# EAGLE design d11toy1 (EAGLE 6.6.0)
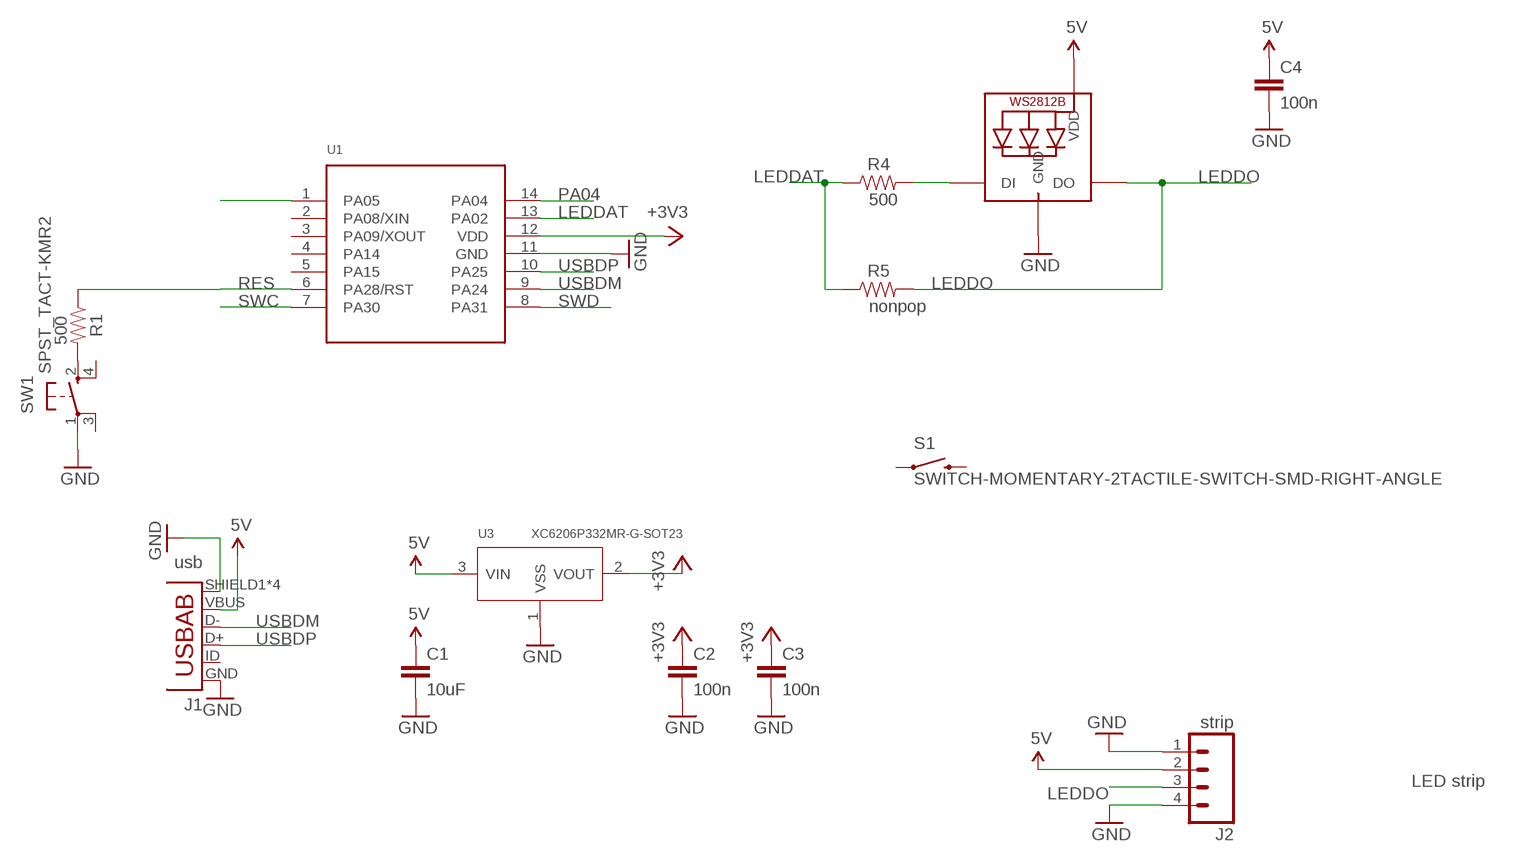
[diagram p0: schematic, sheet 1]

## Parts
C1  10uF  CAP0603-CAP  [0603-CAP]
C2  100n  CAP0603-CAP  [0603-CAP]
C3  100n  CAP0603-CAP  [0603-CAP]
C4  100n  CAP0603-CAP  [0603-CAP]
J1  usb  USB-AB  [USB-AB-MICRO-SMD]
J2  strip  M04NO_SILK_ALL_ROUND  [1X04_NO_SILK_ALL_ROUND]
LED1  WS2812B3535  [LED3535]
R1  500  RESISTOR0603-RES  [0603-RES]
R4  500  RESISTOR0603-RES  [0603-RES]
R5  nonpop  RESISTOR0603-RES  [0603-RES]
S1  SWITCH-MOMENTARY-2TACTILE-SWITCH-SMD-RIGHT-ANGLE  [TACTILE_SWITCH-SMD-RIGHT-ANGLE]
SW1  SPST_TACT-KMR2  [KMR2]
U1  SAMD11C14  [SO14]
U3  XC6206P332MR-G-SOT23  PMIC-LDO-XC6206P332MR-G(SOT23)  [SOT-23]

## Nets
5V: C1.1 C4.1 J1.VBUS J2.2 LED1.2(VDD) U3.3(VIN)
+3V3: C2.1 C3.1 U1.12(VDD) U3.2(VOUT)
GND: C1.2 C2.2 C3.2 C4.2 J1.GND J1.SHIELD1(SHIELD) J1.SHIELD2(SHIELD) J1.SHIELD3(SHIELD) J1.SHIELD4(SHIELD) J2.1 J2.4 LED1.4(GND) SW1.1(P) U1.11(GND) U3.1(VSS)
LEDDAT: R4.1 R5.1 U1.13(PA02)
LEDDO: J2.3 LED1.3(DO) R5.2
N$1: U1.1(PA05)
N$2: R1.2 SW1.2(S)
N$5: LED1.1(DI) R4.2
PA04: U1.14(PA04)
RES: R1.1 U1.6(PA28/RST)
SWC: U1.7(PA30)
SWD: U1.8(PA31)
USBDM: J1.D- U1.9(PA24)
USBDP: J1.D+ U1.10(PA25)
Unconnected: J1.ID(USBID) S1.1 S1.2 SW1.3(P1) SW1.4(S1) U1.2(PA08/XIN) U1.3(PA09/XOUT) U1.4(PA14) U1.5(PA15)

## Notes on the sheet
- LED strip

## Library data of the parts
C1-C4 = SparkFun-Capacitors:CAP: Capacitor Standard 0603 ceramic capacitor, and 0.1" leaded capacitor.
J1 = SparkFun-Connectors:USB-AB: This is a USB AB connector that is compatible with USB OTG. i.e. this connector can serve as a host or device
J2 = SparkFun-Connectors:M04: Header 4 Standard 4-pin 0.1" header. Use with straight break away headers (SKU : PRT-00116), right angle break away headers (PRT-00553), swiss pins (PRT-00743), machine pins (PRT-00117), and female headers (PRT-00115). Molex polarized connector foot print use with SKU : PRT-08231 with associated crimp pins and housings. 1MM SMD Version SKU: PRT-10208; PROD_ID: CONN-09696
LED1 = adafruit:WS2812B
R1 R4 R5 = SparkFun-Passives:RESISTOR: Resistor Basic schematic elements and footprints for 0603, 1206, and PTH resistors.
S1 = SparkFun-Electromechanical:SWITCH-MOMENTARY-2: Various NO switches- pushbuttons, reed, etc; PROD_ID: COMP-12265
SW1 = adafruit:SPST_TACT: SMT 6mm switch, EVQQ2 series http://www.ladyada.net/library/eagle
U1 = todstuff:SAMD11C14: ATSAMD11C14A-SS - SAMD11 14-pin SOIC
U3 = Seeed-IC-2016:PMIC-LDO-XC6206P332MR-G(SOT23): 310030099; MPN: XC6206P332MR-G

## Board
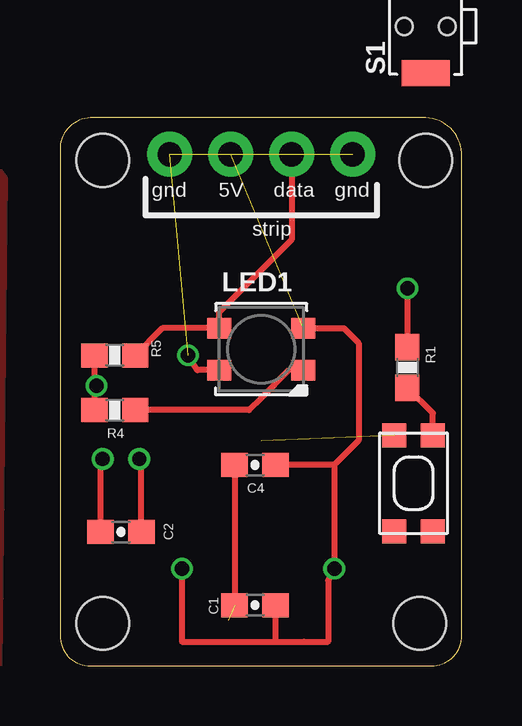
[diagram p1: board, top side]
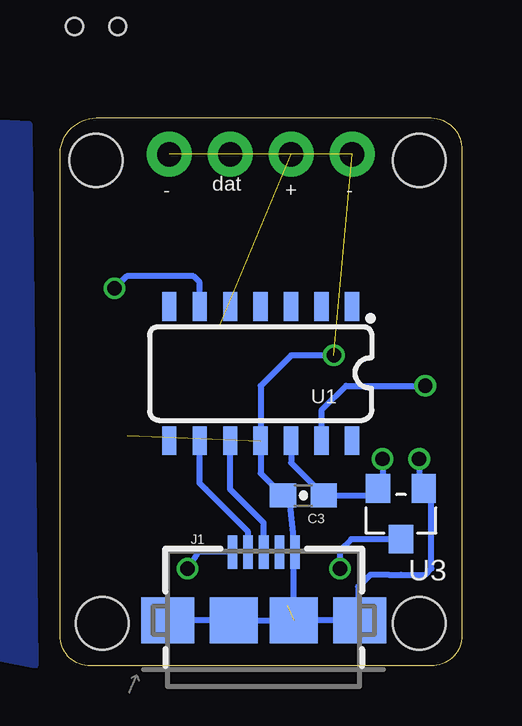
[diagram p2: board, bottom side, seen from below]

Size 16.74 x 22.86 mm. Coordinates in mm from the lower left corner, seen from the top.
Outline: 0,21.51 0,1.27 arc90 1.27,0 15.47,0 arc90 16.74,1.27 16.74,21.26 arc90 15.24,22.86 1.27,22.86 arc90 0,21.51
Copper layers (1*16): Top 0.035mm / dielectric 1.6mm / Bottom 0.035mm
Design rules "Elecrow_2-layer_PCB_eagle_rule": minimum track width 6mil, minimum drill 12mil, track to track 6mil, track to pad 6mil, pad to pad 6mil, via to via 8mil, smd to smd 0mil, copper to edge 20mil, drill to drill 10mil, minimum pad ring 6mil, minimum via ring 6mil, stop-mask expansion 0mil, vias tented up to drill 100mil, thermal gap 10mil
Holes 2.2 mm at 14.99,1.78 15.24,21.08 1.78,1.78 1.78,21.08

### Footprints (pad centres in the part's own frame; a part is rotated, then mirrored left to right if it is on the bottom)
0603-CAP = smd 1.1 x 1: 1 -0.85,0; 2 0.85,0
USB-AB-MICRO-SMD = smd 1.4 x 0.4: D+ 2.85,0; D- 2.85,0.65; GND 2.85,-1.3; ID 2.85,-0.65; VBUS 2.85,1.3 | smd 1.9 x 2.2: SHIELD1 0,4; SHIELD4 0,-4 | smd 1.9 x 2: SHIELD2 0,1.25; SHIELD3 0,-1.25
1X04_NO_SILK_ALL_ROUND = drill 1.016 pad 1.88: 1 0,0; 2 2.54,0; 3 5.08,0; 4 7.62,0
LED3535 = smd 1 x 0.85: 1 -1.75,0.875; 2 -1.75,-0.875; 3 1.75,-0.875; 4 1.75,0.875
0603-RES = smd 1.1 x 1: 1 -0.85,0; 2 0.85,0
TACTILE_SWITCH-SMD-RIGHT-ANGLE = smd 1.1 x 2: 1 -1.95,0; 2 1.95,0 | hole 0.7: 0,0.9; 0,-0.9
KMR2 = smd 1 x 1: 1 2,0.8; 2 2,-0.8; 3 -2,0.8; 4 -2,-0.8
SO14 = smd 0.6 x 1.2: 1 -3.81,-2.8; 2 -2.54,-2.8; 3 -1.27,-2.8; 4 0,-2.8; 5 1.27,-2.8; 6 2.54,-2.8; 7 3.81,-2.8; 8 3.81,2.8; 9 2.54,2.8; 10 1.27,2.8; 11 0,2.8; 12 -1.27,2.8; 13 -2.54,2.8; 14 -3.81,2.8
SOT-23 = smd 1.016 x 1.2: 1 -0.95,-1.06; 2 0.95,-1.06; 3 0,1.06

### Placement (x,y rotation side)
C1  8.13,2.54 180 top
C2  2.54,5.59 180 top
C3  6.6,7.11 180 bottom
C4  8.13,8.38 180 top
J1  8.26,1.91 90 bottom
J2  4.57,21.34 0 top
LED1  8.38,13.21 180 top
R1  14.48,12.45 270 top
R4  2.29,10.67 0 top
R5  2.29,12.95 0 top
S1  15.24,26.67 90 top
SW1  14.73,7.62 90 top
U1  8.38,12.19 180 bottom
U3  2.54,6.35 180 bottom

### Tracks (layer width: path | path; a pad name or v marks a point on that pad's centre or on a via)
5V  (via drill 0.6)  (1 unrouted)
  Top 0.254: v5.08,4.06 5.08,1.02 8.98,1.02 | 8.98,1.02 10.16,1.02 | 10.16,1.02 11.18,1.02 11.18,3.56 v11.43,4.06 11.43,8.38 | C1.1 8.98,1.02 | 8.98,1.02 10.16,1.02 | LED1.2 11.82,14.08 12.45,13.46 12.45,9.4 11.68,8.64 11.43,8.38 | 11.43,8.38 C4.1
  Bottom 0.254: J1.VBUS 10.99,4.75 v11.43,4.06 | U3.3 4.62,5.29 5.08,4.83 v5.08,4.06
  pour Top: -3.81,22.35 -4.06,18.8 -3.81,0 -2.54,0 -2.29,20.32
+3V3  (via drill 0.6)
  Top 0.254: C2.1 3.39,8.72 v3.3,8.64
  Bottom 0.254: U1.12 7.11,8.47 C3.1 3.79,7.11 U3.2 3.3,7.48 v3.3,8.64
GND  (via drill 0.6)  (4 unrouted)
  Top 0.254: C2.2 1.69,8.55 v1.78,8.64 | C4.2 C1.2 | LED1.4 5.73,12.33 v5.33,12.95
  Bottom 0.254: J1.SHIELD4 J1.SHIELD3 | J1.SHIELD1 J1.SHIELD2 J1.SHIELD3 | v1.78,8.64 1.78,7.6 U3.1 1.27,7.09 1.27,4.06 1.52,3.81 2.54,3.81 3.05,3.81 3.81,3.81 4.32,3.3 4.32,1.97 J1.SHIELD4 | J1.SHIELD3 7,4.71 J1.GND 7.21,7.11 C3.2 8.38,8.04 U1.11 8.38,11.68 7.11,12.95 v5.33,12.95 | J1.SHIELD4 4.25,2.35
  pour Bottom: 22.86,22.86 18.03,22.61 17.78,0 24.13,1.27 24.13,19.05
LEDDAT  (via drill 0.6)
  Top 0.254: R5.1 1.44,11.94 | 1.44,11.94 R4.1 | v1.52,11.68 1.44,11.68 1.44,11.94
  Bottom 0.254: U1.13 5.84,10.67 4.83,11.68 v1.52,11.68
LEDDO
  Top 0.254: R5.2 4.26,14.08 LED1.3 6.63,14.76 9.65,17.78 J2.3
N$2
  Top 0.254: SW1.2 15.53,10.54 R1.2
N$5
  Top 0.254: LED1.1 9.54,12.33 8.38,11.18 7.87,10.67 R4.2
RES  (via drill 0.6)
  Top 0.254: v14.48,15.75 R1.1
  Bottom 0.254: U1.6 10.92,16 11.18,16.26 13.97,16.26 v14.48,15.75
USBDM
  Bottom 0.254: J1.D- 8.9,5.6 9.65,6.35 10.67,7.37 10.92,7.62 U1.9
USBDP
  Bottom 0.254: J1.D+ 8.26,5.97 8.64,6.35 9.65,7.37 U1.10

### Text on the board
tPlace: gnd | 5V | data | gnd | strip | BlinkM Neo | blinkm.thingm.com
bPlace: - | + | dat | - | 5V | 5V | A1 | A0 | blinkm_mk2v5c | gnd | gnd